# EAGLE schematic schematic (EAGLE 9.7.0)
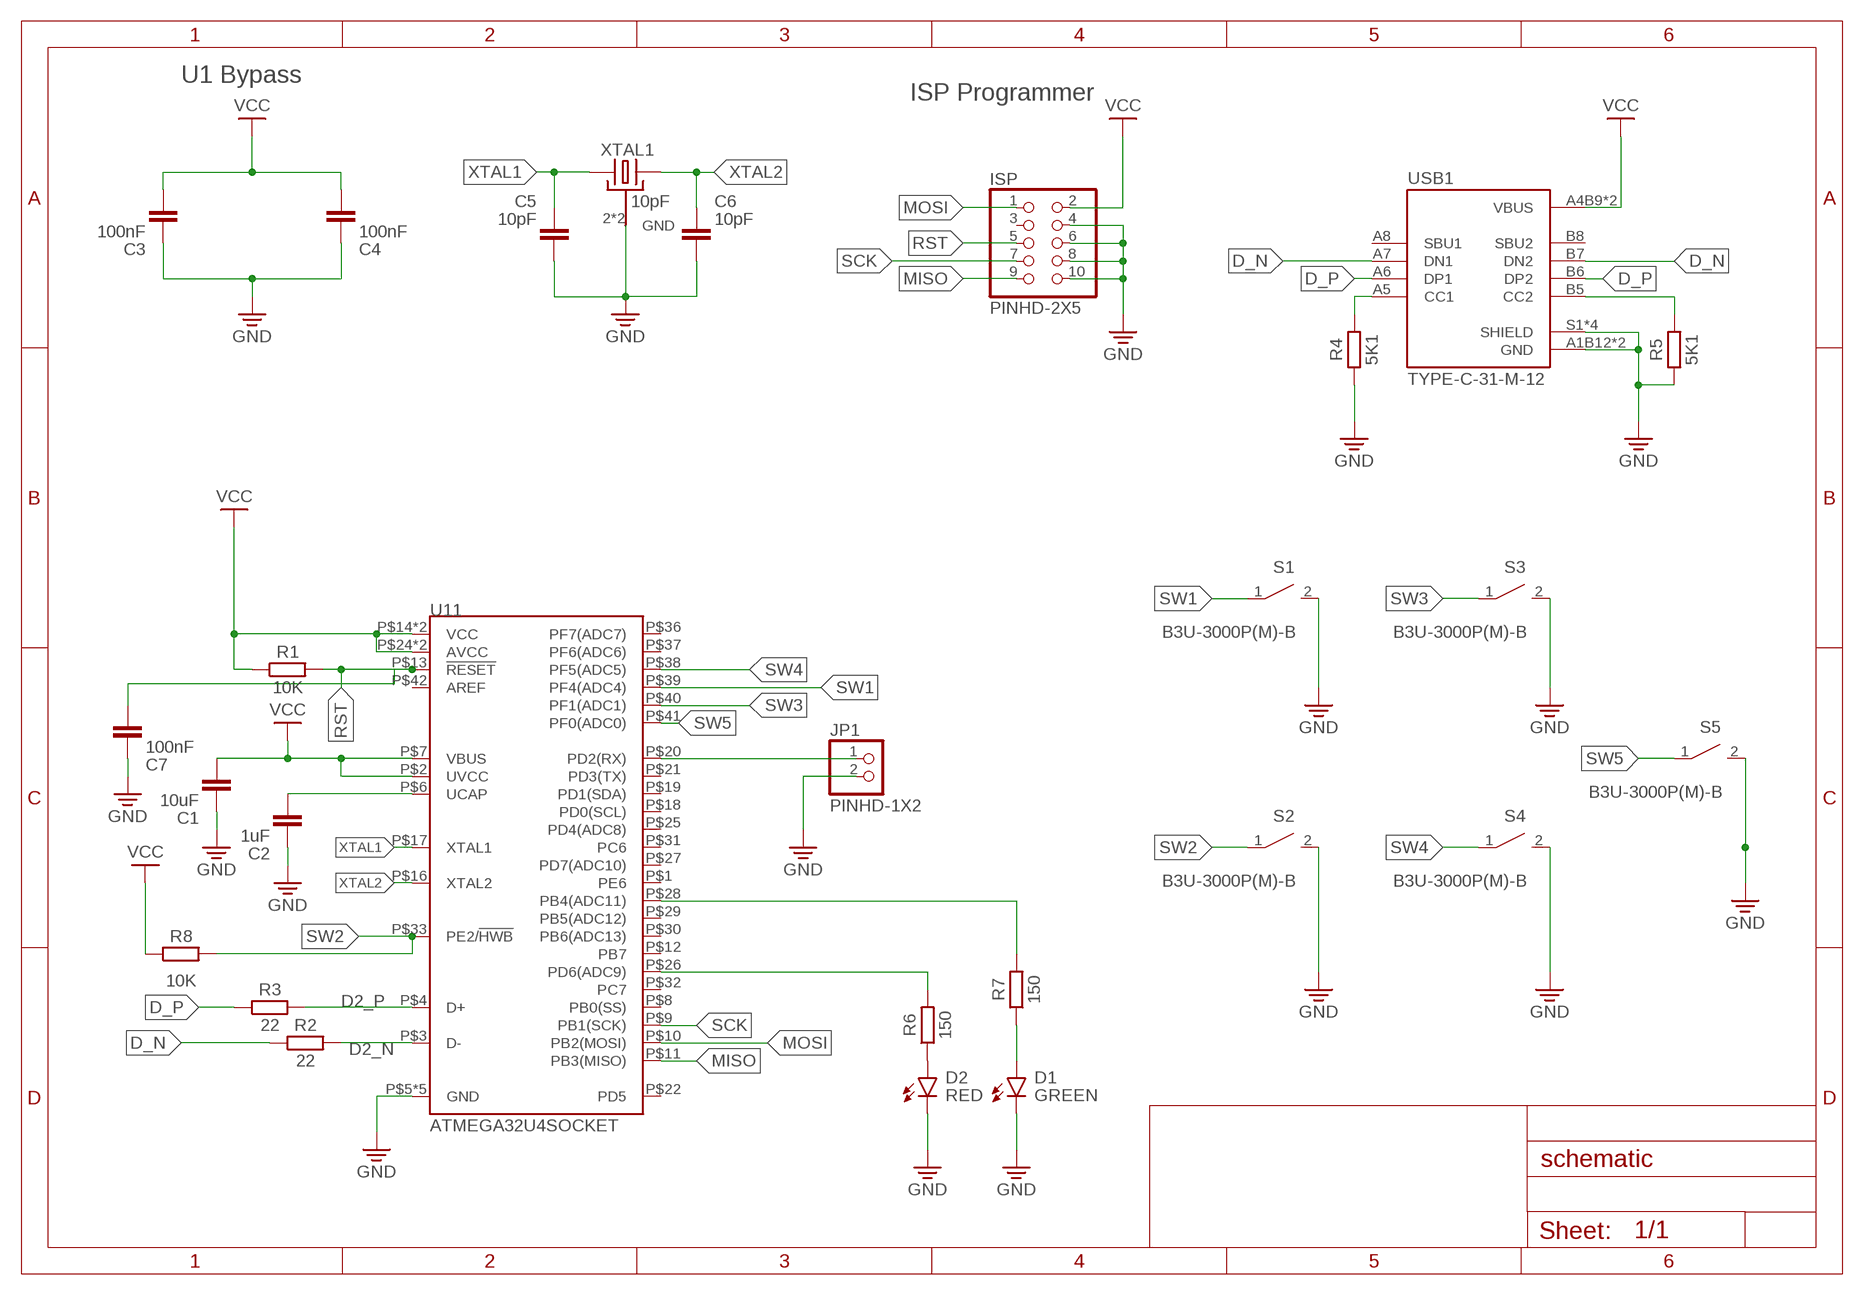
[diagram p0: schematic, sheet 1]

## Parts
C1  10uF  C_CHIP-0805(2012-METRIC)  [CAPC2012X110]
C2  1uF  C_CHIP-0805(2012-METRIC)  [CAPC2012X110]
C3  100nF  C_CHIP-0805(2012-METRIC)  [CAPC2012X110]
C4  100nF  C_CHIP-0805(2012-METRIC)  [CAPC2012X110]
C5  10pF  C_CHIP-0805(2012-METRIC)  [CAPC2012X110]
C6  10pF  C_CHIP-0805(2012-METRIC)  [CAPC2012X110]
C7  100nF  C_CHIP-0805(2012-METRIC)  [CAPC2012X110]
D1  GREEN  CHIP-FLAT-G_1206  [LEDC3216X75N_FLAT-G]
D2  RED  CHIP-FLAT-R_1206  [LEDC3216X75N_FLAT-R]
ISP  PINHD-2X5  [2X05]
JP1  PINHD-1X2  [1X02]
R1  10K  R_CHIP-0805(2012-METRIC)  [RESC2012X65]
R2  22  R_CHIP-0805(2012-METRIC)  [RESC2012X65]
R3  22  R_CHIP-0805(2012-METRIC)  [RESC2012X65]
R4  5K1  R_CHIP-0805(2012-METRIC)  [RESC2012X65]
R5  5K1  R_CHIP-0805(2012-METRIC)  [RESC2012X65]
R6  150  R_CHIP-0805(2012-METRIC)  [RESC2012X65]
R7  150  R_CHIP-0805(2012-METRIC)  [RESC2012X65]
R8  10K  R_CHIP-0805(2012-METRIC)  [RESC2012X65]
S1  B3U-3000P(M)-B  B3U-X000B3U3000P(M)-B3000P(M)-B  [B3U-3000P(M)-B]
S2  B3U-3000P(M)-B  B3U-X000B3U3000P(M)-B3000P(M)-B  [B3U-3000P(M)-B]
S3  B3U-3000P(M)-B  B3U-X000B3U3000P(M)-B3000P(M)-B  [B3U-3000P(M)-B]
S4  B3U-3000P(M)-B  B3U-X000B3U3000P(M)-B3000P(M)-B  [B3U-3000P(M)-B]
S5  B3U-3000P(M)-B  B3U-X000B3U3000P(M)-B3000P(M)-B  [B3U-3000P(M)-B]
U11  ATMEGA32U4SOCKET  [IC51-0444-467]
USB1  TYPE-C-31-M-12  [TYPE-C-31-M-12]
XTAL1  10pF  XTAL-GND  [OSCCC320X250X69N]

## Nets
D2_N: R2.2 U11.P$3(D-)
D2_P: R3.2 U11.P$4(D+)
D_N: R2.1 USB1.A7(DN1) USB1.B7(DN2)
D_P: R3.1 USB1.A6(DP1) USB1.B6(DP2)
GND: C1.1 C2.1 C3.1 C4.1 C5.2 C6.2 C7.1 D1.C D2.C ISP.4 ISP.6 ISP.8 ISP.10 JP1.2 R4.1 R5.1 S1.2 S2.2 S3.2 S4.2 S5.2 U11.P$5(GND) U11.P$15(GND) U11.P$23(GND) U11.P$35(GND) U11.P$43(GND) USB1.A1B12(GND) USB1.B1A12(GND) USB1.S1(SHIELD) USB1.S2(SHIELD) USB1.S3(SHIELD) USB1.S4(SHIELD) XTAL1.2(GND) XTAL1.4(GND)
MISO: ISP.9 U11.P$11(PB3(MISO))
MOSI: ISP.1 U11.P$10(PB2(MOSI))
N$1: R6.2 U11.P$26(PD6(ADC9))
N$2: D2.A R6.1
N$3: C2.2 U11.P$6(UCAP)
N$4: R7.2 U11.P$28(PB4(ADC11))
N$6: R4.2 USB1.A5(CC1)
N$7: R5.2 USB1.B5(CC2)
N$8: D1.A R7.1
N$11: JP1.1 U11.P$20(PD2(RX))
RST: C7.2 ISP.5 R1.2 U11.P$13(!RESET)
SCK: ISP.7 U11.P$9(PB1(SCK))
SW1: S1.1 U11.P$39(PF4(ADC4))
SW2: R8.2 S2.1 U11.P$33(PE2/!HWB)
SW3: S3.1 U11.P$40(PF1(ADC1))
SW4: S4.1 U11.P$38(PF5(ADC5))
SW5: S5.1 U11.P$41(PF0(ADC0))
VCC: C1.2 C3.2 C4.2 ISP.2 R1.1 R8.1 U11.P$2(UVCC) U11.P$7(VBUS) U11.P$14(VCC) U11.P$24(AVCC) U11.P$34(VCC) U11.P$44(AVCC) USB1.A4B9(VBUS) USB1.B4A9(VBUS)
XTAL1: C5.1 U11.P$17(XTAL1) XTAL1.1
XTAL2: C6.1 U11.P$16(XTAL2) XTAL1.3
Unconnected: ISP.3 U11.P$1(PE6) U11.P$8(PB0(SS)) U11.P$12(PB7) U11.P$18(PD0(SCL)) U11.P$19(PD1(SDA)) U11.P$21(PD3(TX)) U11.P$22(PD5) U11.P$25(PD4(ADC8)) U11.P$27(PD7(ADC10)) U11.P$29(PB5(ADC12)) U11.P$30(PB6(ADC13)) U11.P$31(PC6) U11.P$32(PC7) U11.P$36(PF7(ADC7)) U11.P$37(PF6(ADC6)) U11.P$42(AREF) USB1.A8(SBU1) USB1.B8(SBU2)

## Notes on the sheet
- U1 Bypass
- ISP Programmer

## Library data of the parts
C1-C7 = Capacitor:C: Capacitor - Generic; CATEGORY: Capacitor
D1 = LED:CHIP-FLAT-G; CATEGORY: LED; COLOR: GREEN; DESCRIPTION: CHIP LED FLAT; SUB-CATEGORY: CHIP; TYPE: FLAT_TOP; VALUE: LED_GREEN
D2 = LED:CHIP-FLAT-R; CATEGORY: LED; COLOR: RED; DESCRIPTION: CHIP LED FLAT; SUB-CATEGORY: CHIP; TYPE: FLAT_TOP; VALUE: LED_RED
ISP = Connector:PINHD-2X5: PIN HEADER; CATEGORY: Headers; DESCRIPTION: Header, Straight, 2x5 Position; MANUFACTURER: Generic; MPN: Generic; OPERATING_TEMPERATURE: Generic; PART_STATUS: Active; PITCH: 0.100" (2.54mm); ROHS_COMPLIANCE: Generic; SERIES: Generic; SUB-CATEGORY: Headers, Male Pins; TYPE: Board to Board or Cable, Unshrouded, Through Hole, Straight
JP1 = Connector:PINHD-1X2: PIN HEADER; CATEGORY: Headers; DESCRIPTION: Header, Straight, 2 Position; MANUFACTURER: Generic; MPN: Generic; OPERATING_TEMPERATURE: Generic; PART_STATUS: Active; PITCH: 0.100" (2.54mm); ROHS_COMPLIANCE: Generic; SERIES: Generic; SUB-CATEGORY: Headers, Male Pins; TYPE: Board to Board or Cable, Unshrouded, Through Hole, Straight
R1-R8 = Resistor:R: Resistor Fixed - Generic; CATEGORY: Resistor; SUB-CATEGORY: Fixed
S1-S5 = Switch:B3U-X000: Ultra-small Tactile Switch Contact form : SPST-NO Datasheet <https://omronfs.omron.com/en_US/ecb/products/pdf/en-b3u.pdf>; CATEGORY: SWITCH; DESCRIPTION: Ultra-small Surface-mounting Tactile Switches with High Contact Reliability; MANUFACTURER: OMRON; OPERATING_TEMPERATURE: -25°C to +70°C; PART_STATUS: ACTIVE; ROHS_COMPLIANCE: RoHS Compliant; SERIES: B3U; TYPE: Tactile
U11 = _GMLib:ATMEGA32U4: Datasheet: https://datasheet.lcsc.com/lcsc/2304140030_Microchip-Tech-ATMEGA32U4-AU_C44854.pdf
USB1 = _GMLib:TYPE-C-31-M-12: USB-C Connector Datasheet <https://datasheet.lcsc.com/lcsc/2108131730_Korean-Hroparts-Elec-TYPE-C-31-M-12_C165948.pdf>
XTAL1 = _GMLib:XTAL-GND